# EAGLE schematic CarPC-CC-Integrated (EAGLE 9.5.2)
Car-PC Command & Control sowie Power Distribution Board für PC, Access-Point

## Sheet 1 of 5
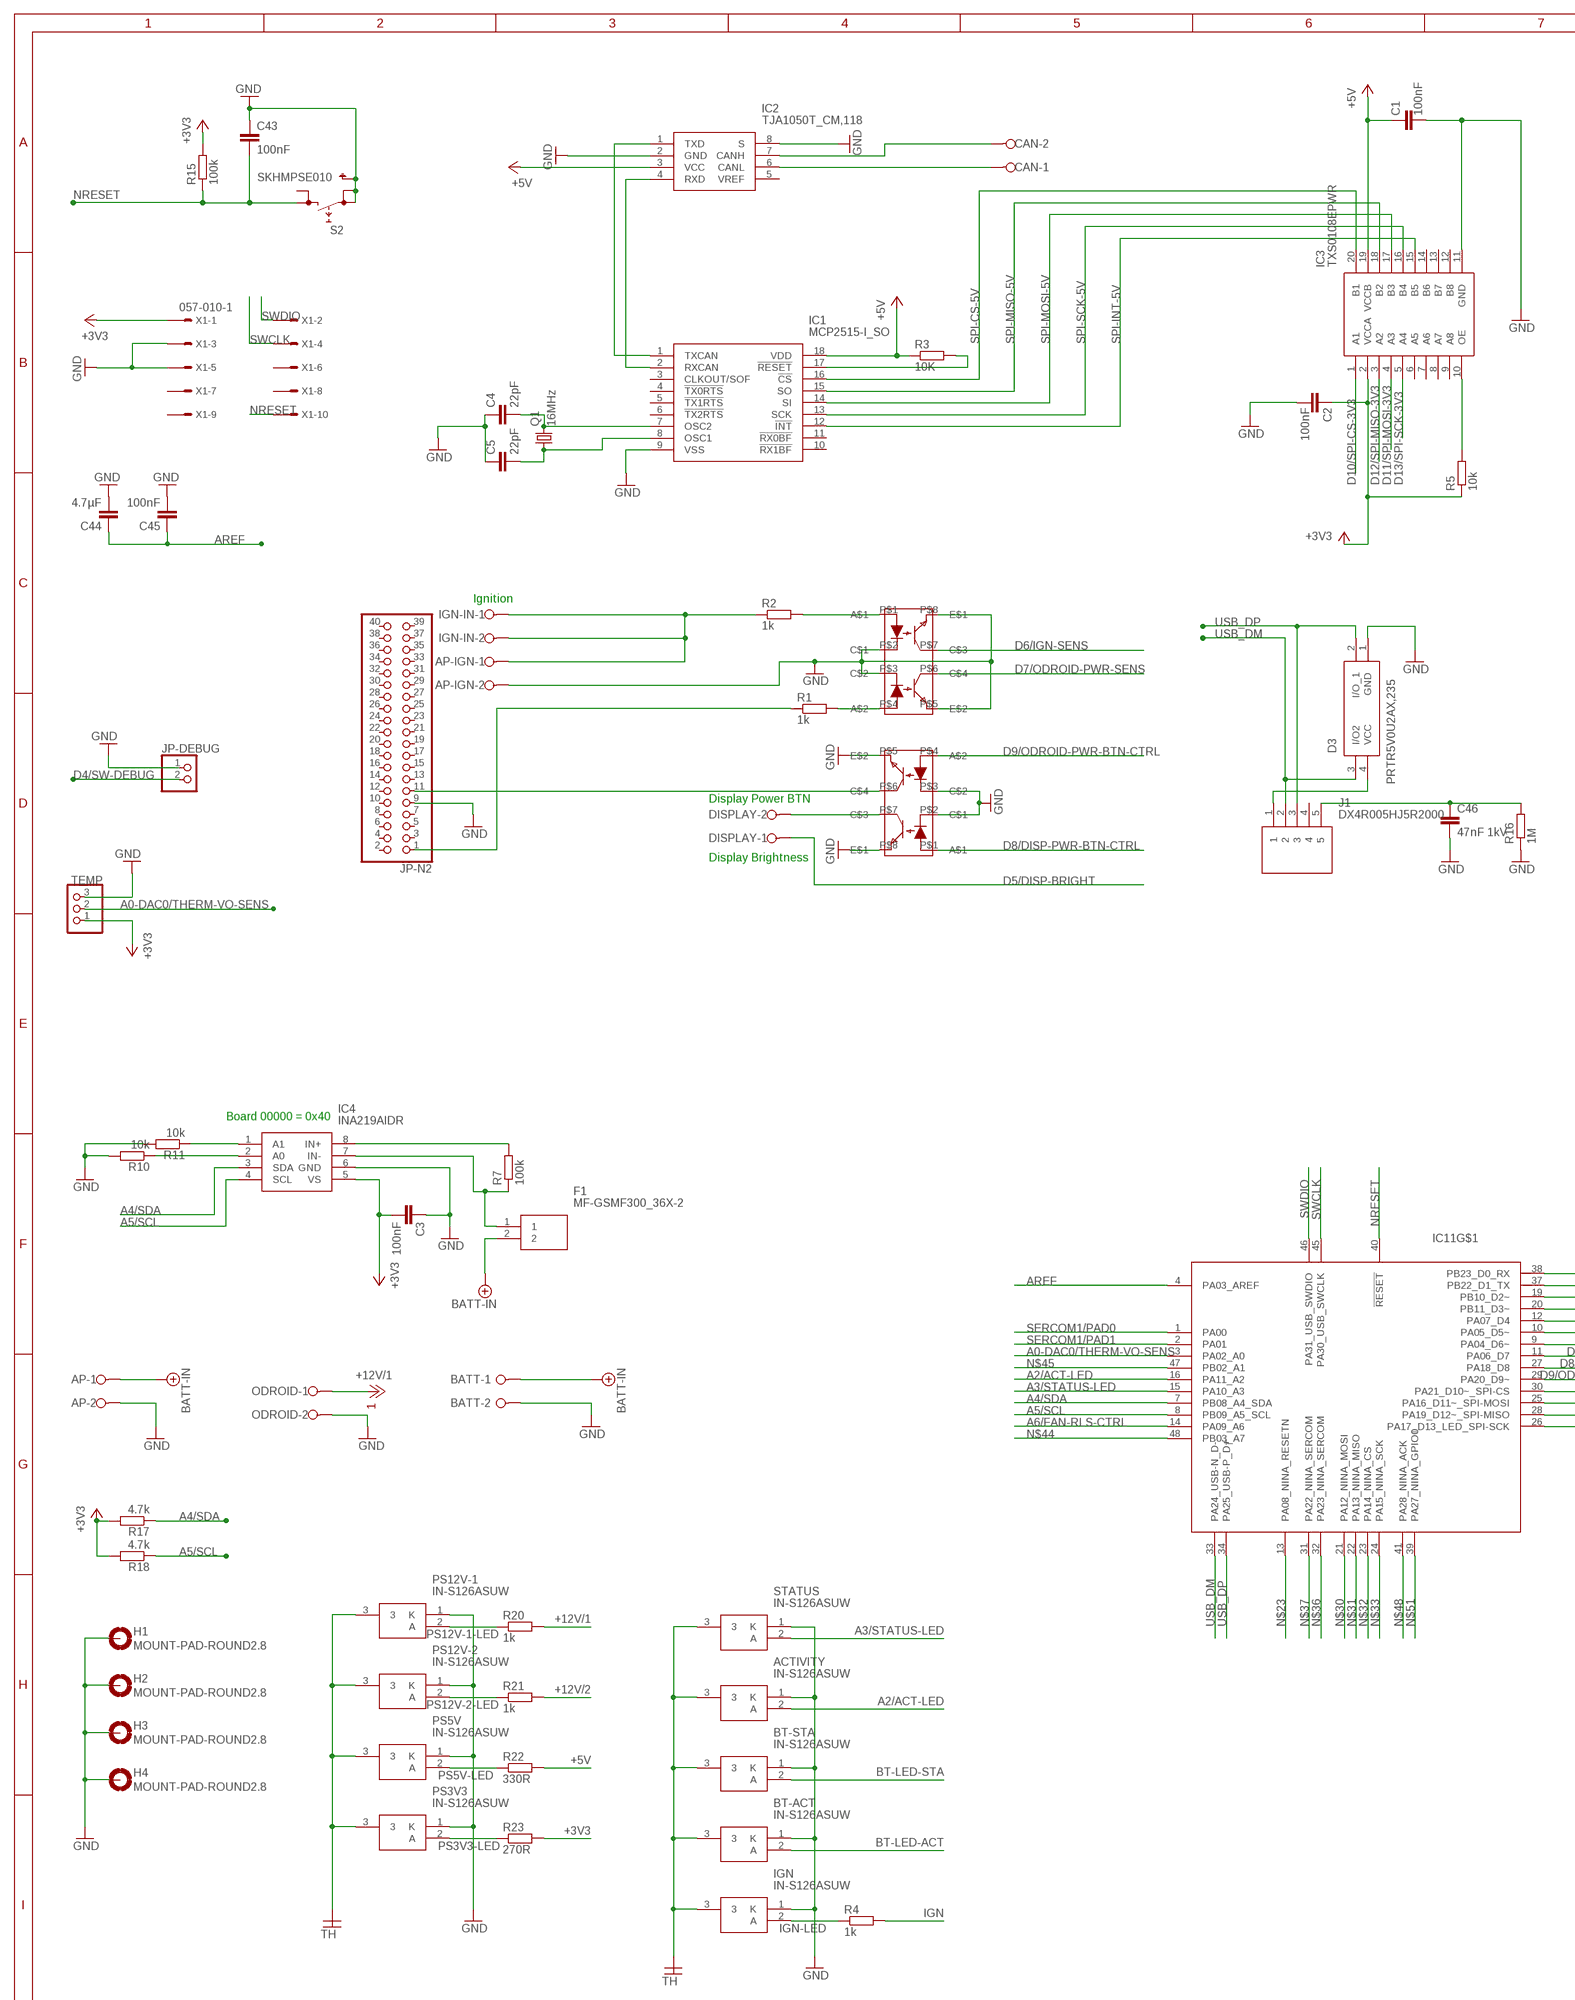
[diagram p0: schematic, sheet 1, part 1 of 2]
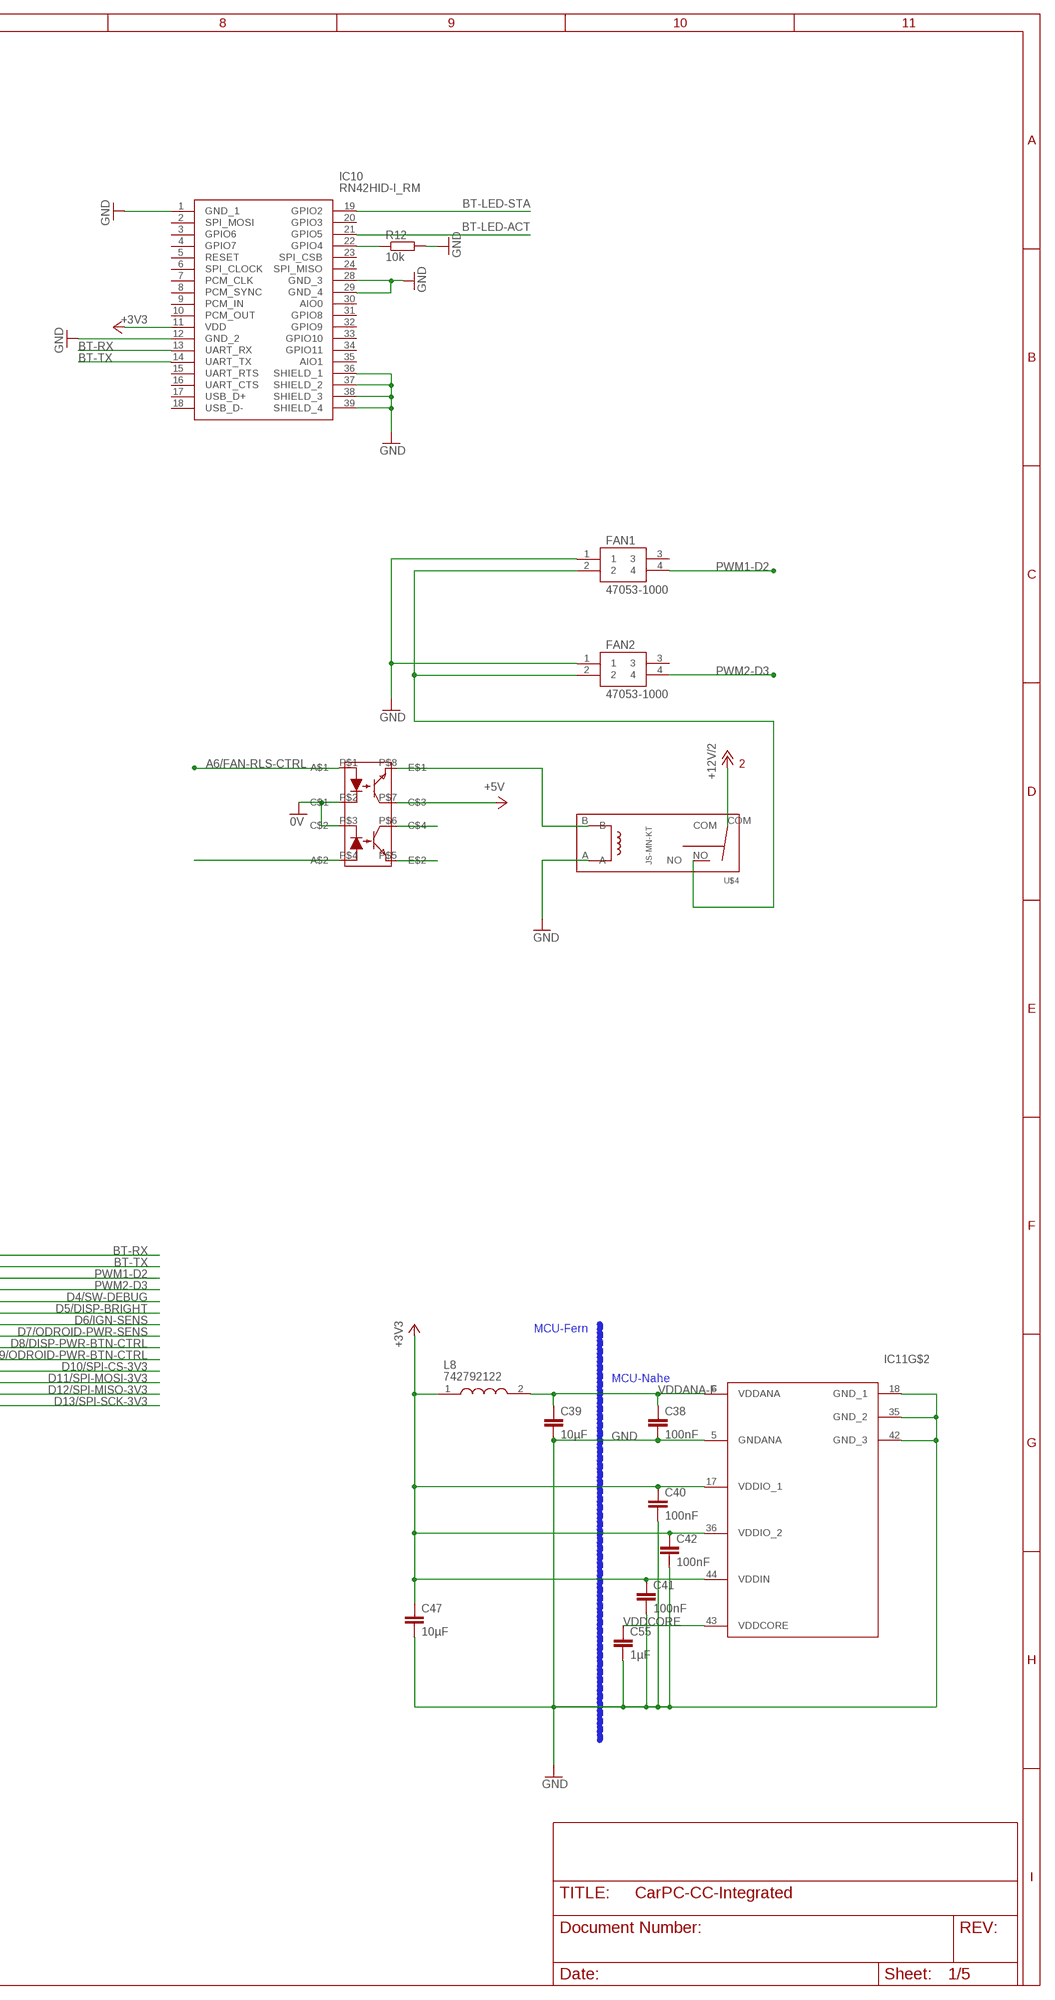
[diagram p1: schematic, sheet 1, part 2 of 2]

### Parts
ACTIVITY  IN-S126ASUW  [INS126ASUW]
AP  W237-02P  [W237-132]
AP-IGN  W237-02P  [W237-132]
BATT  W237-02P  [W237-132]
BT-ACT  IN-S126ASUW  [INS126ASUW]
BT-STA  IN-S126ASUW  [INS126ASUW]
C1  100nF  C-EUC1206  [C1206]
C2  100nF  C-EUC1206  [C1206]
C3  100nF  C-EUC1206  [C1206]
C4  22pF  C-EUC1206  [C1206]
C5  22pF  C-EUC1206  [C1206]
C38  100nF  C-EUC1206  [C1206]
C39  10µF  C-EUC1206  [C1206]
C40  100nF  C-EUC1206  [C1206]
C41  100nF  C-EUC1206  [C1206]
C42  100nF  C-EUC1206  [C1206]
C43  100nF  C-EUC1206  [C1206]
C44  4.7µF  C-EUC1206  [C1206]
C45  100nF  C-EUC1206  [C1206]
C46  47nF 1kV  C-EUC1206  [C1206]
C47  10µF  C-EUC1206  [C1206]
C55  1µF  C-EUC1206  [C1206]
CAN  W237-02P  [W237-132]
D3  PRTR5V0U2AX,235  [PESD2ETHAXR]
DISPLAY  W237-02P  [W237-132]
F1  MF-GSMF300_36X-2  [MFGSMF30036X2]
FAN1  47053-1000  [47053-1000]
FAN2  47053-1000  [47053-1000]
H1  MOUNT-PAD-ROUND2.8  [2,8-PAD]
H2  MOUNT-PAD-ROUND2.8  [2,8-PAD]
H3  MOUNT-PAD-ROUND2.8  [2,8-PAD]
H4  MOUNT-PAD-ROUND2.8  [2,8-PAD]
IC1  MCP2515-I_SO  [SOIC127P1030X265-18N]
IC2  TJA1050T_CM,118  [SOIC127P600X175-8N]
IC3  TXS0108EPWR  [SOP65P640X120-20N]
IC4  INA219AIDR  [SOIC127P600X175-8N]
IC10  RN42HID-I_RM  [RN42HIDIRM]
IC11  ATSAMD21G18A-AU-SPLIT  [QFP50P900X900X120-48N]
IGN  IN-S126ASUW  [INS126ASUW]
IGN-IN  W237-02P  [W237-132]
J1  DX4R005HJ5R2000  [DX4R005HJ5]
JP-DEBUG  PINHD-1X2  [1X02]
JP-N2  PINHD-2X20  [2X20]
L8  742792122  [INDC3216X130N]
ODROID  W237-02P  [W237-132]
OK-FAN-CTRL  ILD74  [FPR_ILD74]
OK-PWR-IGN  ILD74  [FPR_ILD74]
OK-PWR-N2_DISP  ILD74  [FPR_ILD74]
PS3V3  IN-S126ASUW  [INS126ASUW]
PS5V  IN-S126ASUW  [INS126ASUW]
PS12V-1  IN-S126ASUW  [INS126ASUW]
PS12V-2  IN-S126ASUW  [INS126ASUW]
Q1  16MHz  CRYSTALHC49S  [HC49/S]
R1  1k  R-EU_R1206  [R1206]
R2  1k  R-EU_R1206  [R1206]
R3  10K  R-EU_R1206  [R1206]
R4  1k  R-EU_R1206  [R1206]
R5  10k  R-EU_R1206  [R1206]
R7  100k  R-EU_R1206  [R1206]
R10  10k  R-EU_R1206  [R1206]
R11  10k  R-EU_R1206  [R1206]
R12  10k  R-EU_R1206  [R1206]
R15  100k  R-EU_R1206  [R1206]
R16  1M  R-EU_R1206  [R1206]
R17  4.7k  R-EU_R1206  [R1206]
R18  4.7k  R-EU_R1206  [R1206]
R20  1k  R-EU_R1206  [R1206]
R21  1k  R-EU_R1206  [R1206]
R22  330R  R-EU_R1206  [R1206]
R23  270R  R-EU_R1206  [R1206]
S2  SKHMPSE010  [SKHMPXE010]
STATUS  IN-S126ASUW  [INS126ASUW]
TEMP  PINHD-1X3/90  [1X03/90]
U$4  JS-MN-KT  [FPR_JS-MN-KT]
X1  057-010-1  [057-010-1]

### Nets
0V [Chassis]: OK-FAN-CTRL.P$2(C$1) OK-FAN-CTRL.P$3(C$2)
+3V3 [3V3 Arduino]: C2.1 C3.2 C40.1 C41.1 C42.1 C47.1 IC3.2(VCCA) IC4.5(VS) IC10.11(VDD) IC11.17(VDDIO_1) IC11.36(VDDIO_2) IC11.44(VDDIN) L8.1 R5.1 R15.2 R17.2 R18.2 R23.2 TEMP.1 X1.1 ; also sheet 4
+5V [5v Regulated]: C1.1 IC1.18(VDD) IC2.3(VCC) IC3.19(VCCB) OK-FAN-CTRL.P$7(C$3) R3.1 R22.2 ; also sheet 4
+12V/1: ODROID.1 R20.2 ; also sheet 2,4
+12V/2 [12v Regulated]: R21.2 U$4.COM ; also sheet 3
A0-DAC0/THERM-VO-SENS [3V3 Arduino]: IC11.3(PA02_A0) TEMP.2
A2/ACT-LED [3V3 Arduino]: ACTIVITY.2(A) IC11.16(PA11_A2)
A3/STATUS-LED [3V3 Arduino]: IC11.15(PA10_A3) STATUS.2(A)
A4/SDA [3V3 Signal]: IC4.3(SDA) IC11.7(PB08_A4_SDA) R17.1
A5/SCL [3V3 Signal]: IC4.4(SCL) IC11.8(PB09_A5_SCL) R18.1
A6/FAN-RLS-CTRL [3V3 Arduino]: IC11.14(PA09_A6) OK-FAN-CTRL.P$1(A$1)
AREF [3V3 Arduino]: C44.1 C45.1 IC11.4(PA03_AREF)
BATT-IN [11..14v Unfused]: AP.1 BATT.1 F1.2 ; also sheet 2,3
BATT-IN-FUSED [11..14v Generator]: F1.1 IC4.7(IN-) R7.1
BT-ACTIVATE [Chassis]: IC10.22(GPIO4) R12.1
BT-LED-ACT: BT-ACT.2(A) IC10.21(GPIO5)
BT-LED-STA: BT-STA.2(A) IC10.19(GPIO2)
BT-RX: IC10.13(UART_RX) IC11.38(PB23_D0_RX)
BT-TX: IC10.14(UART_TX) IC11.37(PB22_D1_TX)
CAN-H [5V Signal]: CAN.2 IC2.7(CANH)
CAN-L [5V Signal]: CAN.1 IC2.6(CANL)
D4/SW-DEBUG [3V3 Arduino]: IC11.12(PA07_D4) JP-DEBUG.2
D5/DISP-BRIGHT [3V3 Arduino]: DISPLAY.1 IC11.10(PA05_D5~)
D6/IGN-SENS [3V3 Arduino]: IC11.9(PA04_D6~) OK-PWR-IGN.P$7(C$3)
D7/ODROID-PWR-SENS [3V3 Arduino]: IC11.11(PA06_D7) OK-PWR-IGN.P$6(C$4)
D8/DISP-PWR-BTN-CTRL [3V3 Arduino]: IC11.27(PA18_D8) OK-PWR-N2_DISP.P$1(A$1)
D9/ODROID-PWR-BTN-CTRL [3V3 Arduino]: IC11.29(PA20_D9~) OK-PWR-N2_DISP.P$4(A$2)
D10/SPI-CS-3V3 [3V3 Signal]: IC3.1(A1) IC11.30(PA21_D10~_SPI-CS)
D11/SPI-MOSI-3V3 [3V3 Signal]: IC3.4(A3) IC11.25(PA16_D11~_SPI-MOSI)
D12/SPI-MISO-3V3 [3V3 Signal]: IC3.3(A2) IC11.28(PA19_D12~_SPI-MISO)
D13/SPI-SCK-3V3 [3V3 Signal]: IC3.5(A4) IC11.26(PA17_D13_LED_SPI-SCK)
DISP-PWR-BTN [3V3 Signal]: DISPLAY.2 OK-PWR-N2_DISP.P$7(C$3)
FAN-12V [12v Regulated]: FAN1.2 FAN2.2 U$4.NO
FAN-RLS-TRIG [5v Regulated]: OK-FAN-CTRL.P$8(E$1) U$4.B
GND [Chassis]: ACTIVITY.1(K) AP-IGN.2 AP.2 BATT.2 BT-ACT.1(K) BT-STA.1(K) C1.2 C2.2 C3.1 C4.1 C5.1 C38.2 C39.2 C40.2 C41.2 C42.2 C43.1 C44.2 C45.2 C46.2 C47.2 C55.2 D3.1(GND) FAN1.1 FAN2.1 H1.B2,8(MOUNT) H2.B2,8(MOUNT) H3.B2,8(MOUNT) H4.B2,8(MOUNT) IC1.9(VSS) IC2.2(GND) IC2.8(S) IC3.11(GND) IC4.6(GND) IC10.1(GND_1) IC10.12(GND_2) IC10.28(GND_3) IC10.29(GND_4) IC10.36(SHIELD_1) IC10.37(SHIELD_2) IC10.38(SHIELD_3) IC10.39(SHIELD_4) IC11.5(GNDANA) IC11.18(GND_1) IC11.35(GND_2) IC11.42(GND_3) IGN.1(K) JP-DEBUG.1 JP-N2.9 ODROID.2 OK-PWR-IGN.P$2(C$1) OK-PWR-IGN.P$3(C$2) OK-PWR-IGN.P$5(E$2) OK-PWR-IGN.P$8(E$1) OK-PWR-N2_DISP.P$2(C$1) OK-PWR-N2_DISP.P$3(C$2) OK-PWR-N2_DISP.P$5(E$2) OK-PWR-N2_DISP.P$8(E$1) PS3V3.1(K) PS5V.1(K) PS12V-1.1(K) PS12V-2.1(K) R10.2 R11.2 R12.2 R16.1 S2.1(1.1) S2.2(1.2) S2.5(SH) STATUS.1(K) TEMP.3 U$4.A X1.3 X1.5 ; also sheet 2,3,4
IGN [11..14v Ignition]: AP-IGN.1 IGN-IN.1 IGN-IN.2 R2.1 R4.2
IGN-IN [12v Regulated]: OK-PWR-IGN.P$1(A$1) R2.2
IGN-LED [11..14v Ignition]: IGN.2(A) R4.1
INA-0X40-ADDR0: IC4.2(A0) R10.1
INA-0X40-ADDR1: IC4.1(A1) R11.1
MCP-OSC1 [5V Signal]: C5.2 IC1.8(OSC1) Q1.1
MCP-OSC2 [5V Signal]: C4.2 IC1.7(OSC2) Q1.2
MCP-RESET: IC1.17(!RESET) R3.2
MCP-TJA-RX [5V Signal]: IC1.2(RXCAN) IC2.4(RXD)
MCP-TJA-TX [5V Signal]: IC1.1(TXCAN) IC2.1(TXD)
N$3: OK-FAN-CTRL.P$4(A$2)
N$4: OK-FAN-CTRL.P$6(C$4)
N$6: OK-FAN-CTRL.P$5(E$2)
N$23: IC11.13(PA08_NINA_RESETN)
N$25: D3.4(VCC) J1.1
N$30: IC11.21(PA12_NINA_MOSI)
N$31: IC11.22(PA13_NINA_MISO)
N$32: IC11.23(PA14_NINA_CS)
N$33: IC11.24(PA15_NINA_SCK)
N$36: IC11.32(PA23_NINA_SERCOM)
N$37: IC11.31(PA22_NINA_SERCOM)
N$44: IC11.48(PB03_A7)
N$45: IC11.47(PB02_A1)
N$48: IC11.41(PA28_NINA_ACK)
N$51: IC11.39(PA27_NINA_GPIO0)
NRESET: C43.2 IC11.40(!RESET) R15.1 S2.3(2.1) X1.10
ODROID-3V3 [3V3 Arduino]: JP-N2.1 R1.1
ODROID-3V3$2: OK-PWR-IGN.P$4(A$2) R1.2
ODROID-PWR-BTN [3V3 Signal]: JP-N2.11 OK-PWR-N2_DISP.P$6(C$4)
OE [3V3 Arduino]: IC3.10(OE) R5.2
PS3V3-LED [3V3 Arduino]: PS3V3.2(A) R23.1
PS5V-LED [5v Regulated]: PS5V.2(A) R22.1
PS12V-1-LED: PS12V-1.2(A) R20.1
PS12V-2-LED [12v Regulated]: PS12V-2.2(A) R21.1
PWM1-D2 [3V3 Signal]: FAN1.4 IC11.19(PB10_D2~)
PWM2-D3 [3V3 Signal]: FAN2.4 IC11.20(PB11_D3~)
SERCOM1/PAD0: IC11.1(PA00)
SERCOM1/PAD1: IC11.2(PA01)
SHUNT+ [11..14v Generator]: IC4.8(IN+) R7.2
SPI-CS-5V [5V Signal]: IC1.16(!CS) IC3.20(B1)
SPI-INT-5V [5V Signal]: IC1.12(!INT) IC3.15(B5)
SPI-MISO-5V [5V Signal]: IC1.15(SO) IC3.18(B2)
SPI-MOSI-5V [5V Signal]: IC1.14(SI) IC3.17(B3)
SPI-SCK-5V [5V Signal]: IC1.13(SCK) IC3.16(B4)
SWCLK: IC11.45(PA30_USB_SWCLK) X1.4
SWDIO: IC11.46(PA31_USB_SWDIO) X1.2
TH: ACTIVITY.3 BT-ACT.3 BT-STA.3 IGN.3 PS3V3.3 PS5V.3 PS12V-1.3 PS12V-2.3 STATUS.3
USB-GND [Chassis]: C46.1 J1.5 R16.2
USB_DM [5V Signal]: D3.3(I/O2) IC11.33(PA24_USB-N_D-) J1.2
USB_DP [5V Signal]: D3.2(I/O_1) IC11.34(PA25_USB-P_D+) J1.3
VDDANA-F [3V3 Arduino]: C38.1 C39.1 IC11.6(VDDANA) L8.2
VDDCORE: C55.1 IC11.43(VDDCORE)
Unconnected: FAN1.3 FAN2.3 IC1.3(CLKOUT/SOF) IC1.4(!TX0RTS) IC1.5(!TX1RTS) IC1.6(!TX2RTS) IC1.10(!RX1BF) IC1.11(!RX0BF) IC2.5(VREF) IC3.6(A5) IC3.7(A6) IC3.8(A7) IC3.9(A8) IC3.12(B8) IC3.13(B7) IC3.14(B6) IC10.2(SPI_MOSI) IC10.3(GPIO6) IC10.4(GPIO7) IC10.5(RESET) IC10.6(SPI_CLOCK) IC10.7(PCM_CLK) IC10.8(PCM_SYNC) IC10.9(PCM_IN) IC10.10(PCM_OUT) IC10.15(UART_RTS) IC10.16(UART_CTS) IC10.17(USB_D+) IC10.18(USB_D-) IC10.20(GPIO3) IC10.23(SPI_CSB) IC10.24(SPI_MISO) IC10.30(AIO0) IC10.31(GPIO8) IC10.32(GPIO9) IC10.33(GPIO10) IC10.34(GPIO11) IC10.35(AIO1) J1.4 JP-N2.2 JP-N2.3 JP-N2.4 JP-N2.5 JP-N2.6 JP-N2.7 JP-N2.8 JP-N2.10 JP-N2.12 JP-N2.13 JP-N2.14 JP-N2.15 JP-N2.16 JP-N2.17 JP-N2.18 JP-N2.19 JP-N2.20 JP-N2.21 JP-N2.22 JP-N2.23 JP-N2.24 JP-N2.25 JP-N2.26 JP-N2.27 JP-N2.28 JP-N2.29 JP-N2.30 JP-N2.31 JP-N2.32 JP-N2.33 JP-N2.34 JP-N2.35 JP-N2.36 JP-N2.37 JP-N2.38 JP-N2.39 JP-N2.40 S2.4(2.2) X1.6 X1.7 X1.8 X1.9

### Notes on the sheet
- Ignition
- Display Power BTN
- Display Brightness
- Board 00000 = 0x40
- MCU-Fern
- MCU-Nahe

## Sheet 2 of 5: 12V Power Supply Rail 1 (PC)
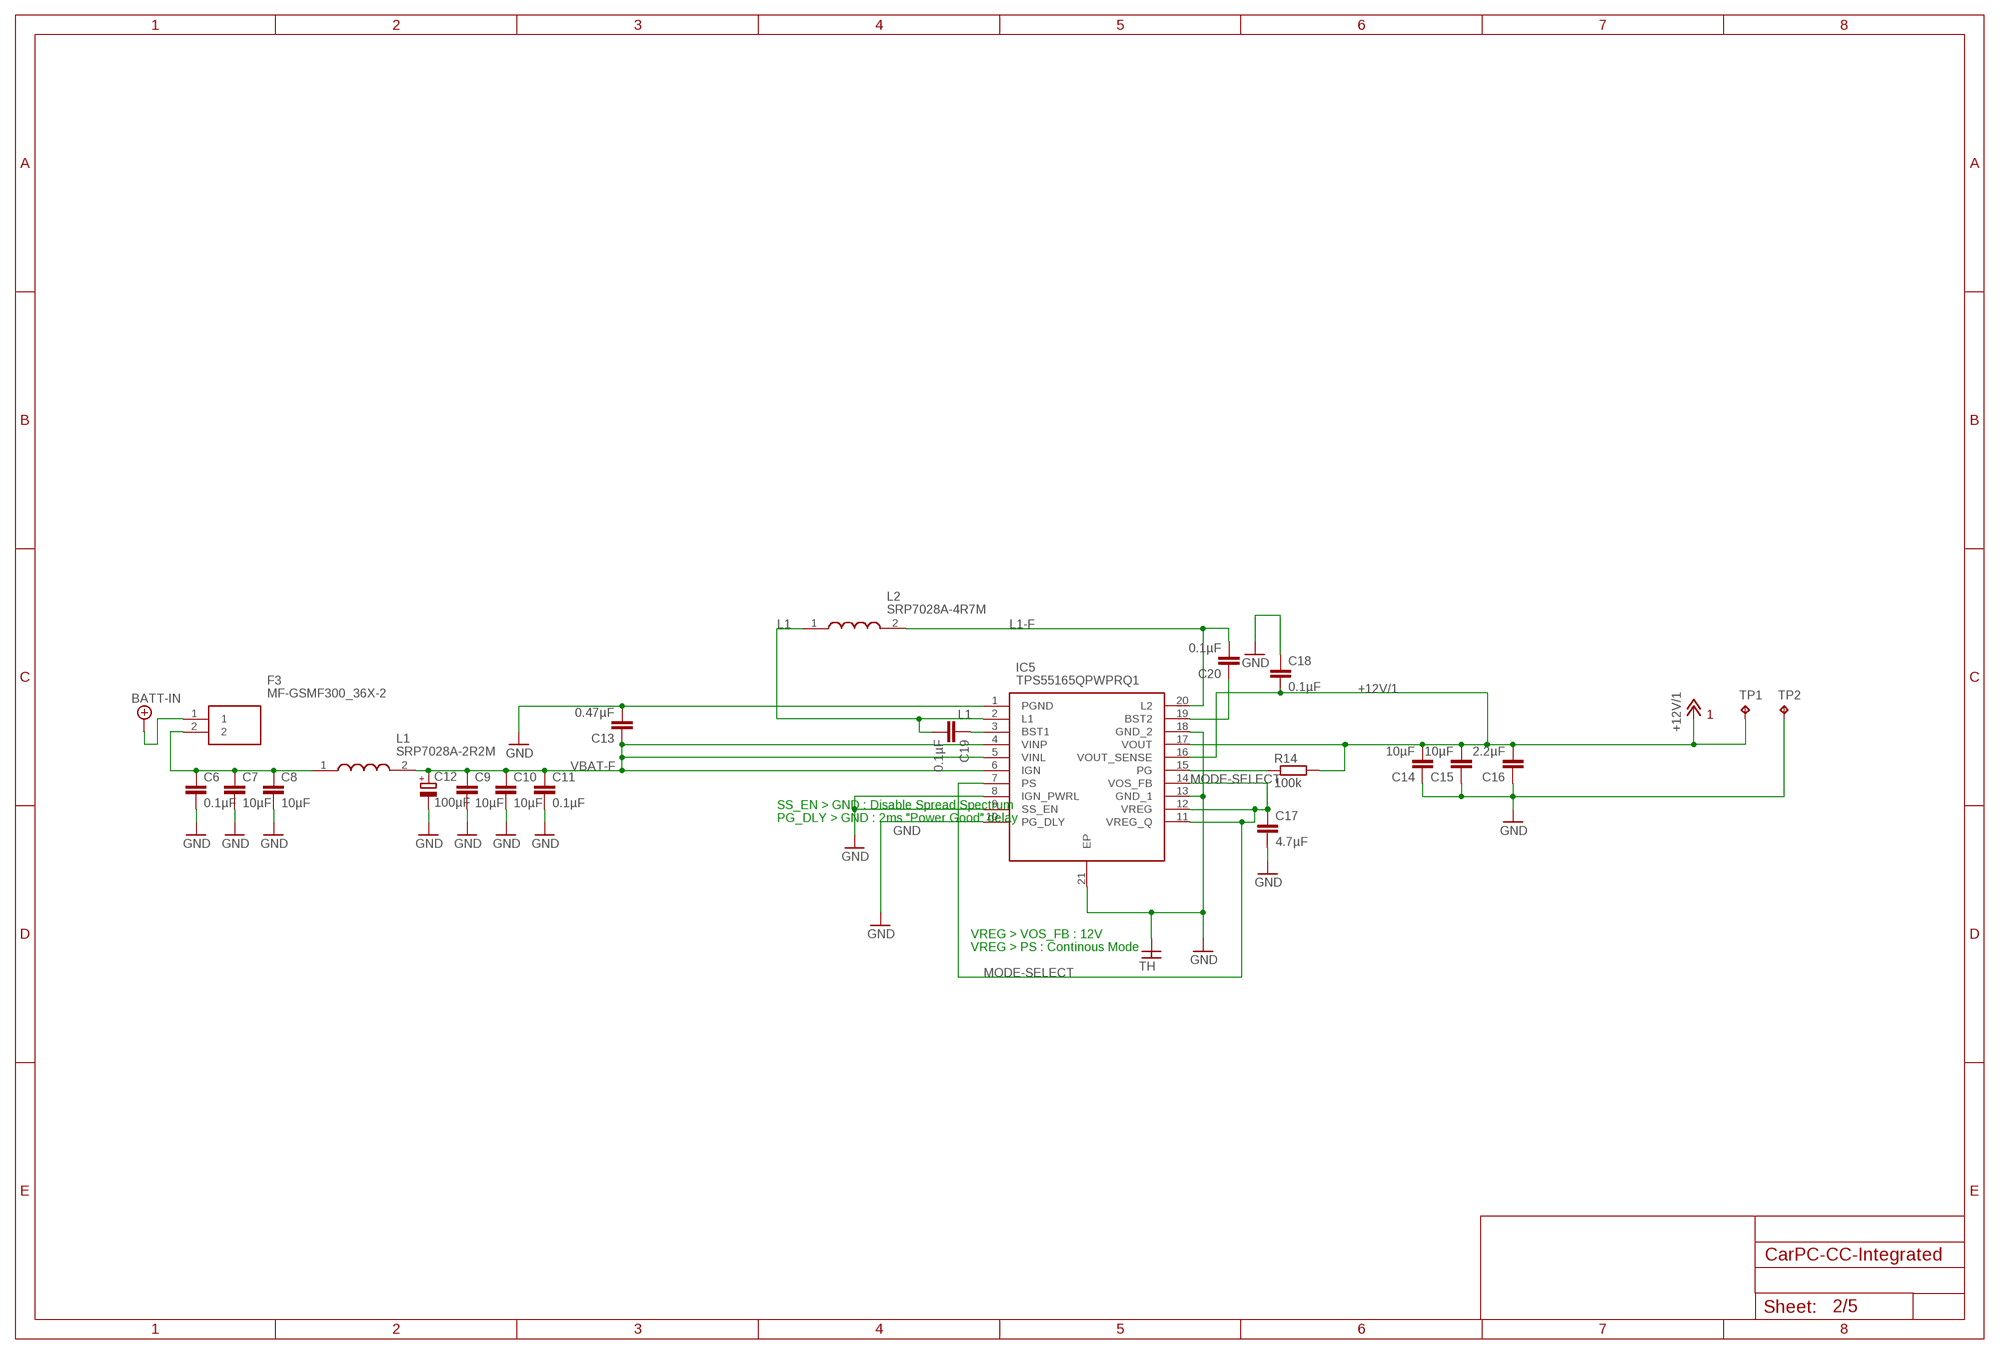
[diagram p2: schematic, sheet 2]

### Parts
C6  0.1µF  C-EUC1206  [C1206]
C7  10µF  C-EUC1206  [C1206]
C8  10µF  C-EUC1206  [C1206]
C9  10µF  C-EUC1206  [C1206]
C10  10µF  C-EUC1206  [C1206]
C11  0.1µF  C-EUC1206  [C1206]
C12  100µF  CPOL-EUSMCB  [SMC_B]
C13  0.47µF  C-EUC1206  [C1206]
C14  10µF  C-EUC1206  [C1206]
C15  10µF  C-EUC1206  [C1206]
C16  2.2µF  C-EUC1206  [C1206]
C17  4.7µF  C-EUC1206  [C1206]
C18  0.1µF  C-EUC1206  [C1206]
C19  0.1µF  C-EUC1206  [C1206]
C20  0.1µF  C-EUC1206  [C1206]
F3  MF-GSMF300_36X-2  [MFGSMF30036X2]
IC5  TPS55165QPWPRQ1  [SOP65P640X120-21N]
L1  SRP7028A-2R2M  [INDM7366X300N]
L2  SRP7028A-4R7M  [INDM7366X300N]
R14  100k  R-EU_R1206  [R1206]
TP1  TPTP20R  [TP20R]
TP2  TPTP20R  [TP20R]

### Nets
+12V/1: C14.2 C15.2 C16.2 C18.2 IC5.16(VOUT_SENSE) IC5.17(VOUT) R14.2 TP1.TP ; also sheet 1,4
BATT-F [11..14v Generator]: C6.1 C7.1 C8.1 F3.2 L1.1
BATT-IN [11..14v Unfused]: F3.1 ; also sheet 1,3
BST1 [12v Regulated]: C19.1 IC5.3(BST1)
BST2: C20.1 IC5.19(BST2)
GND [Chassis]: C6.2 C7.2 C8.2 C9.2 C10.2 C11.2 C12.- C13.2 C14.1 C15.1 C16.1 C17.2 C18.1 IC5.1(PGND) IC5.8(IGN_PWRL) IC5.9(SS_EN) IC5.10(PG_DLY) IC5.13(GND_1) IC5.18(GND_2) IC5.21(EP) TP2.TP ; supply symbol labelled TH ; also sheet 1,3,4
L1 [12v Regulated]: C19.2 IC5.2(L1) L2.1
L1-F [12v Regulated]: C20.2 IC5.20(L2) L2.2
MODE-SELECT: C17.1 IC5.7(PS) IC5.11(VREG_Q) IC5.12(VREG) IC5.14(VOS_FB)
POWER-GOOD/1: IC5.15(PG) R14.1
VBAT-F [11..14v Generator]: C9.1 C10.1 C11.1 C12.+ C13.1 IC5.4(VINP) IC5.5(VINL) IC5.6(IGN) L1.2

### Notes on the sheet
- SS_EN > GND : Disable Spread Spectrum
- PG_DLY > GND : 2ms "Power Good" delay
- VREG > VOS_FB : 12V
- VREG > PS : Continous Mode

## Sheet 3 of 5: 12V Power Supply Rail 2 (Fans)
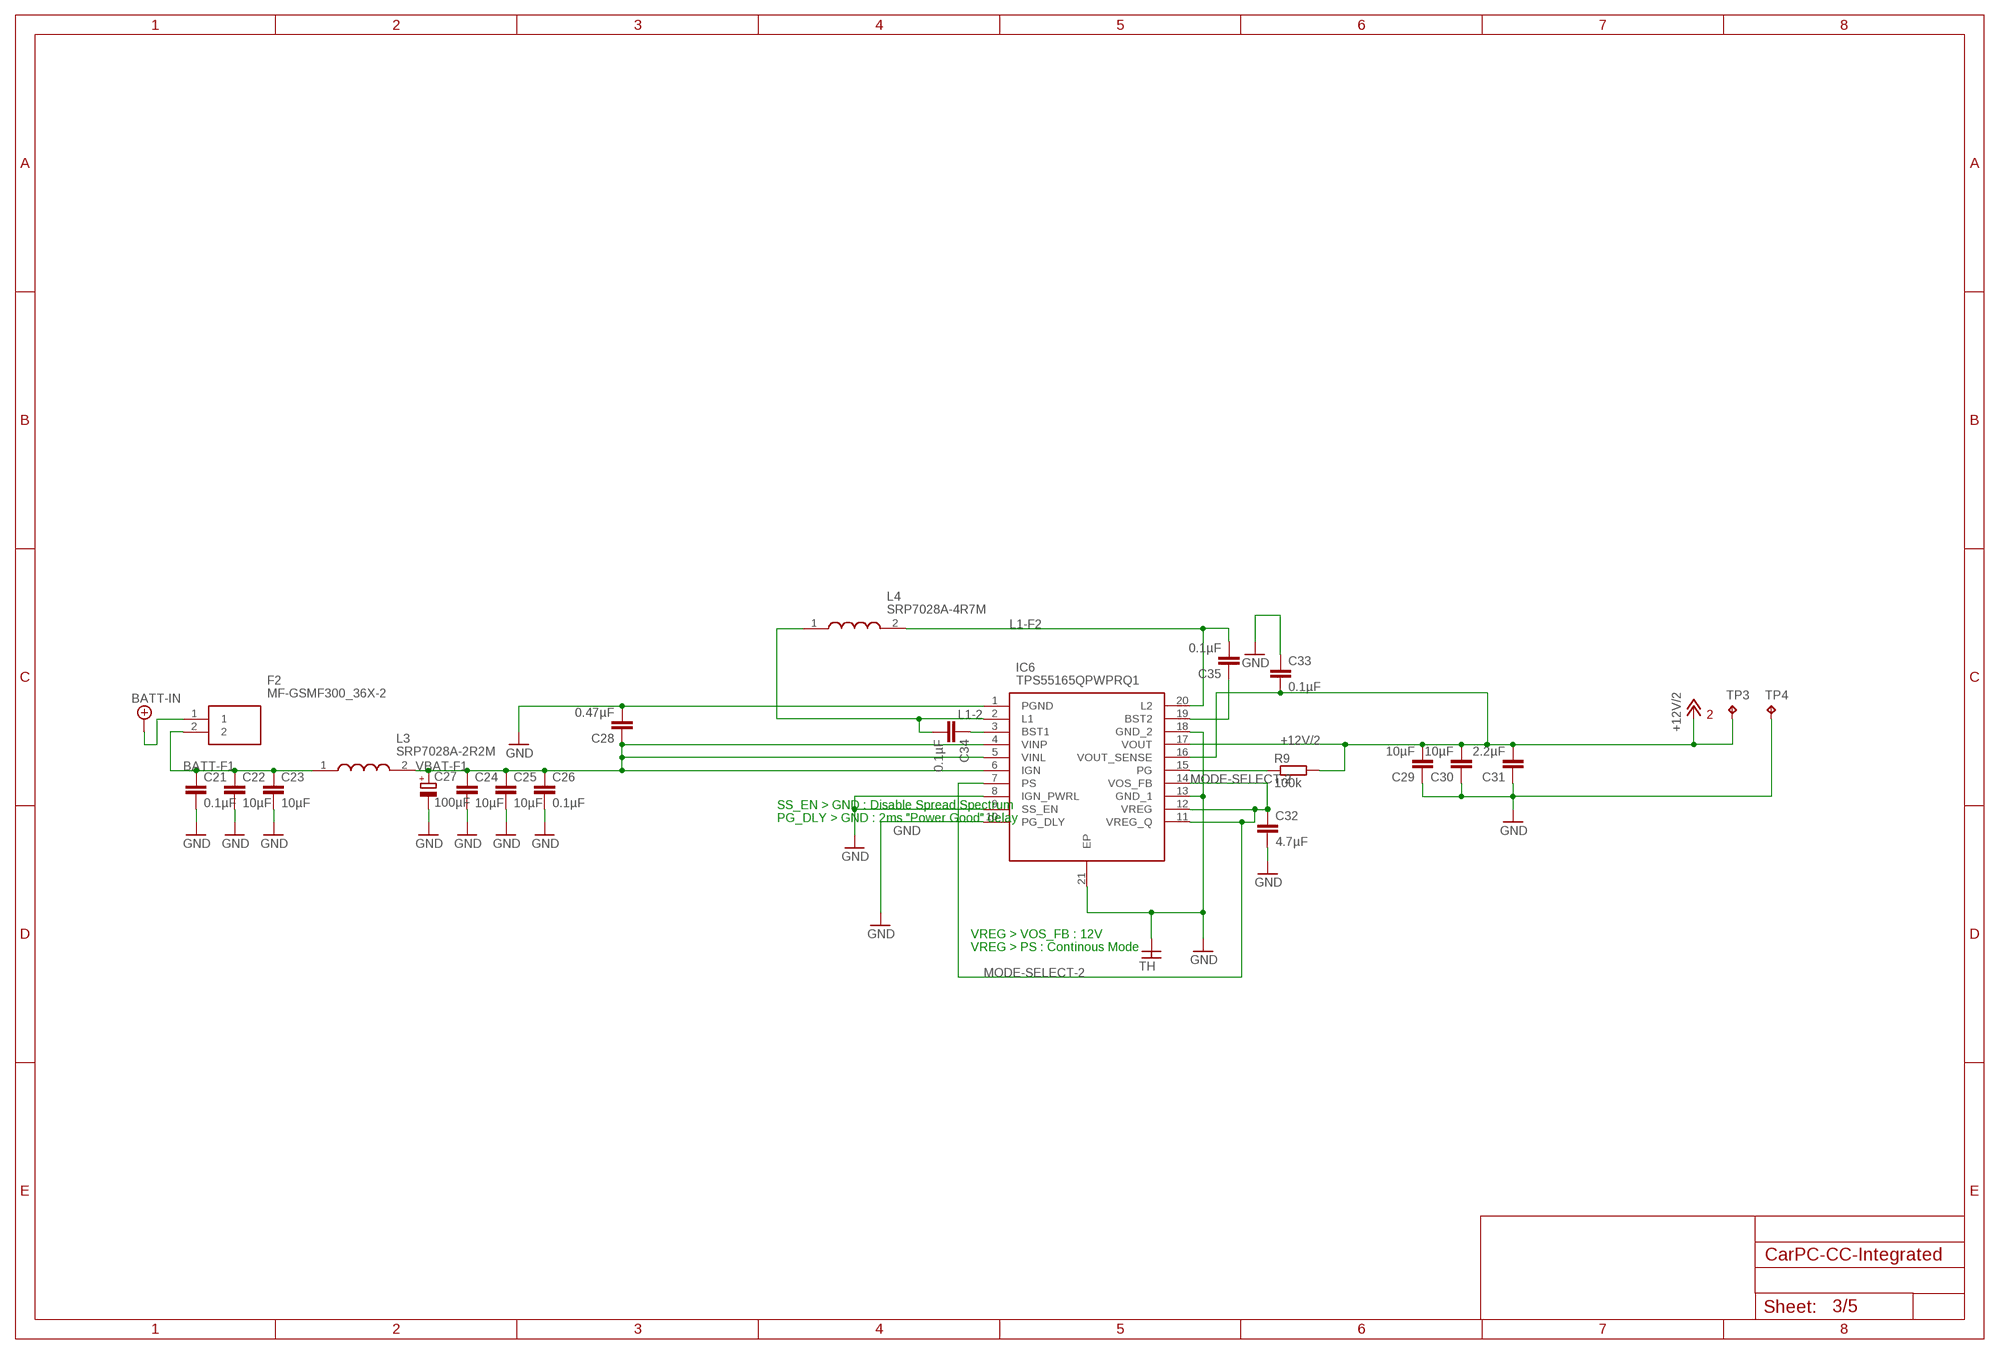
[diagram p3: schematic, sheet 3]

### Parts
C21  0.1µF  C-EUC1206  [C1206]
C22  10µF  C-EUC1206  [C1206]
C23  10µF  C-EUC1206  [C1206]
C24  10µF  C-EUC1206  [C1206]
C25  10µF  C-EUC1206  [C1206]
C26  0.1µF  C-EUC1206  [C1206]
C27  100µF  CPOL-EUSMCB  [SMC_B]
C28  0.47µF  C-EUC1206  [C1206]
C29  10µF  C-EUC1206  [C1206]
C30  10µF  C-EUC1206  [C1206]
C31  2.2µF  C-EUC1206  [C1206]
C32  4.7µF  C-EUC1206  [C1206]
C33  0.1µF  C-EUC1206  [C1206]
C34  0.1µF  C-EUC1206  [C1206]
C35  0.1µF  C-EUC1206  [C1206]
F2  MF-GSMF300_36X-2  [MFGSMF30036X2]
IC6  TPS55165QPWPRQ1  [SOP65P640X120-21N]
L3  SRP7028A-2R2M  [INDM7366X300N]
L4  SRP7028A-4R7M  [INDM7366X300N]
R9  100k  R-EU_R1206  [R1206]
TP3  TPTP20R  [TP20R]
TP4  TPTP20R  [TP20R]

### Nets
+12V/2 [12v Regulated]: C29.2 C30.2 C31.2 C33.2 IC6.16(VOUT_SENSE) IC6.17(VOUT) R9.2 TP3.TP ; also sheet 1
BATT-F1 [11..14v Generator]: C21.1 C22.1 C23.1 F2.2 L3.1
BATT-IN [11..14v Unfused]: F2.1 ; also sheet 1,2
BST1-2 [12v Regulated]: C34.1 IC6.3(BST1)
BST2-2: C35.1 IC6.19(BST2)
GND [Chassis]: C21.2 C22.2 C23.2 C24.2 C25.2 C26.2 C27.- C28.2 C29.1 C30.1 C31.1 C32.2 C33.1 IC6.1(PGND) IC6.8(IGN_PWRL) IC6.9(SS_EN) IC6.10(PG_DLY) IC6.13(GND_1) IC6.18(GND_2) IC6.21(EP) TP4.TP ; supply symbol labelled TH ; also sheet 1,2,4
L1-2 [12v Regulated]: C34.2 IC6.2(L1) L4.1
L1-F2 [12v Regulated]: C35.2 IC6.20(L2) L4.2
MODE-SELECT-2: C32.1 IC6.7(PS) IC6.11(VREG_Q) IC6.12(VREG) IC6.14(VOS_FB)
POWER-GOOD/2: IC6.15(PG) R9.1
VBAT-F1 [11..14v Generator]: C24.1 C25.1 C26.1 C27.+ C28.1 IC6.4(VINP) IC6.5(VINL) IC6.6(IGN) L3.2

### Notes on the sheet
- SS_EN > GND : Disable Spread Spectrum
- PG_DLY > GND : 2ms "Power Good" delay
- VREG > VOS_FB : 12V
- VREG > PS : Continous Mode

## Sheet 4 of 5: 3V3 and 5V Converters for ATSAMD21 and supplemental ICs
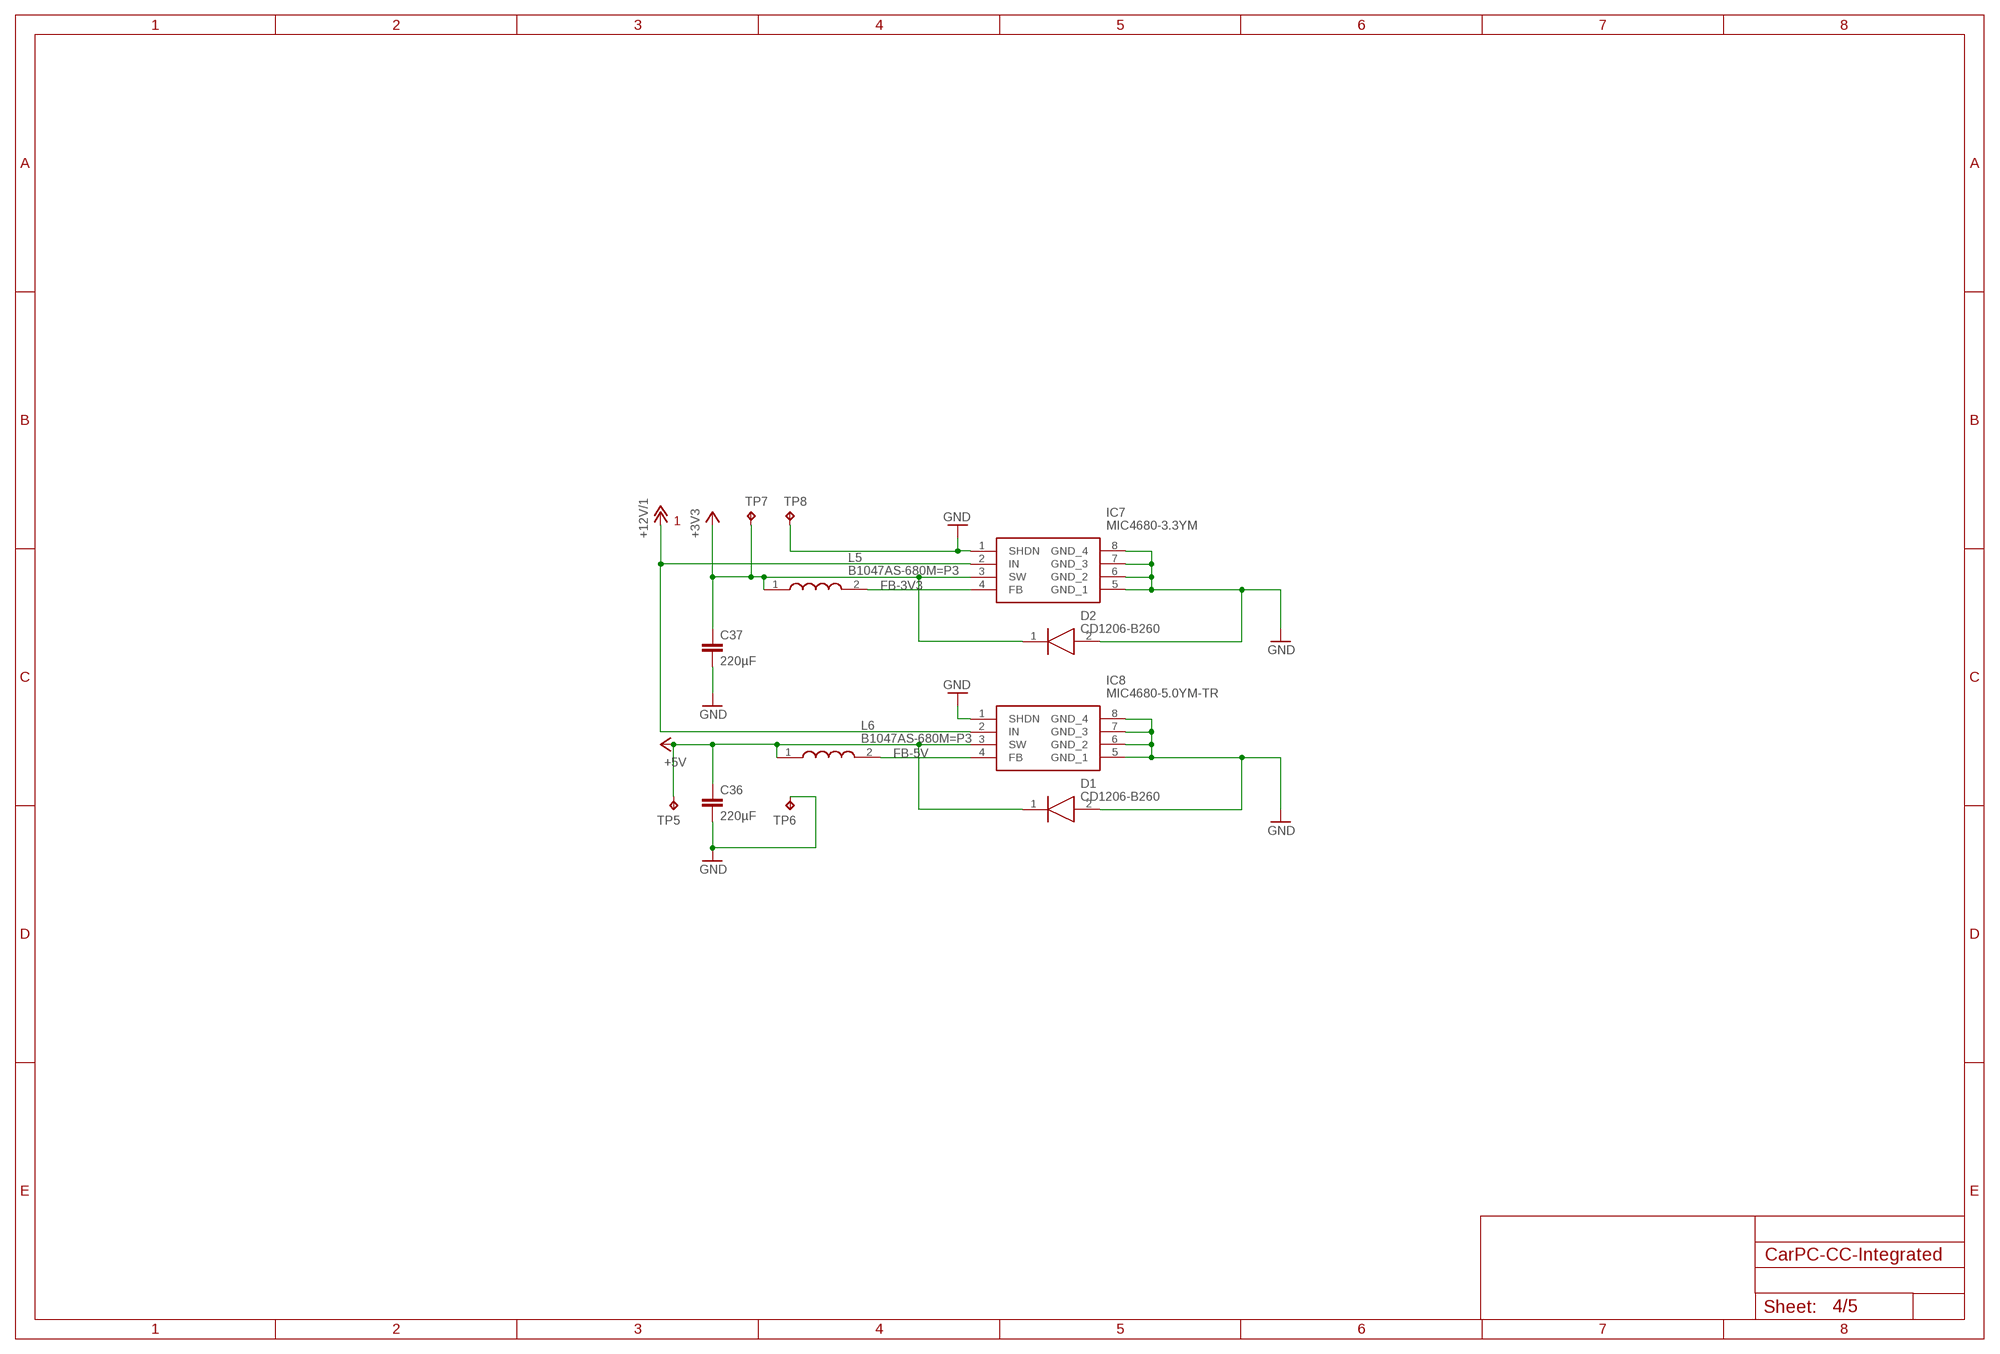
[diagram p4: schematic, sheet 4]

### Parts
C36  220µF  C-EUC1206  [C1206]
C37  220µF  C-EUC1206  [C1206]
D1  CD1206-B260  [DIOC3419X116N]
D2  CD1206-B260  [DIOC3419X116N]
IC7  MIC4680-3.3YM  [SOIC127P599X173-8N]
IC8  MIC4680-5.0YM-TR  [SOIC127P599X173-8N]
L5  B1047AS-680M=P3  [INDPM7373X500N]
L6  B1047AS-680M=P3  [INDPM7373X500N]
TP5  TPTP20R  [TP20R]
TP6  TPTP20R  [TP20R]
TP7  TPTP20R  [TP20R]
TP8  TPTP20R  [TP20R]

### Nets
+3V3 [3V3 Arduino]: C37.1 D2.1(K) IC7.3(SW) L5.1 TP7.TP ; also sheet 1
+5V [5v Regulated]: C36.1 D1.1(K) IC8.3(SW) L6.1 TP5.TP ; also sheet 1
+12V/1: IC7.2(IN) IC8.2(IN) ; also sheet 1,2
FB-3V3 [3V3 Arduino]: IC7.4(FB) L5.2
FB-5V [5v Regulated]: IC8.4(FB) L6.2
GND [Chassis]: C36.2 C37.2 D1.2(A) D2.2(A) IC7.1(SHDN) IC7.5(GND_1) IC7.6(GND_2) IC7.7(GND_3) IC7.8(GND_4) IC8.1(SHDN) IC8.5(GND_1) IC8.6(GND_2) IC8.7(GND_3) IC8.8(GND_4) TP6.TP TP8.TP ; also sheet 1,2,3

## Sheet 5 of 5: ATSAMD21G18 Power Supply
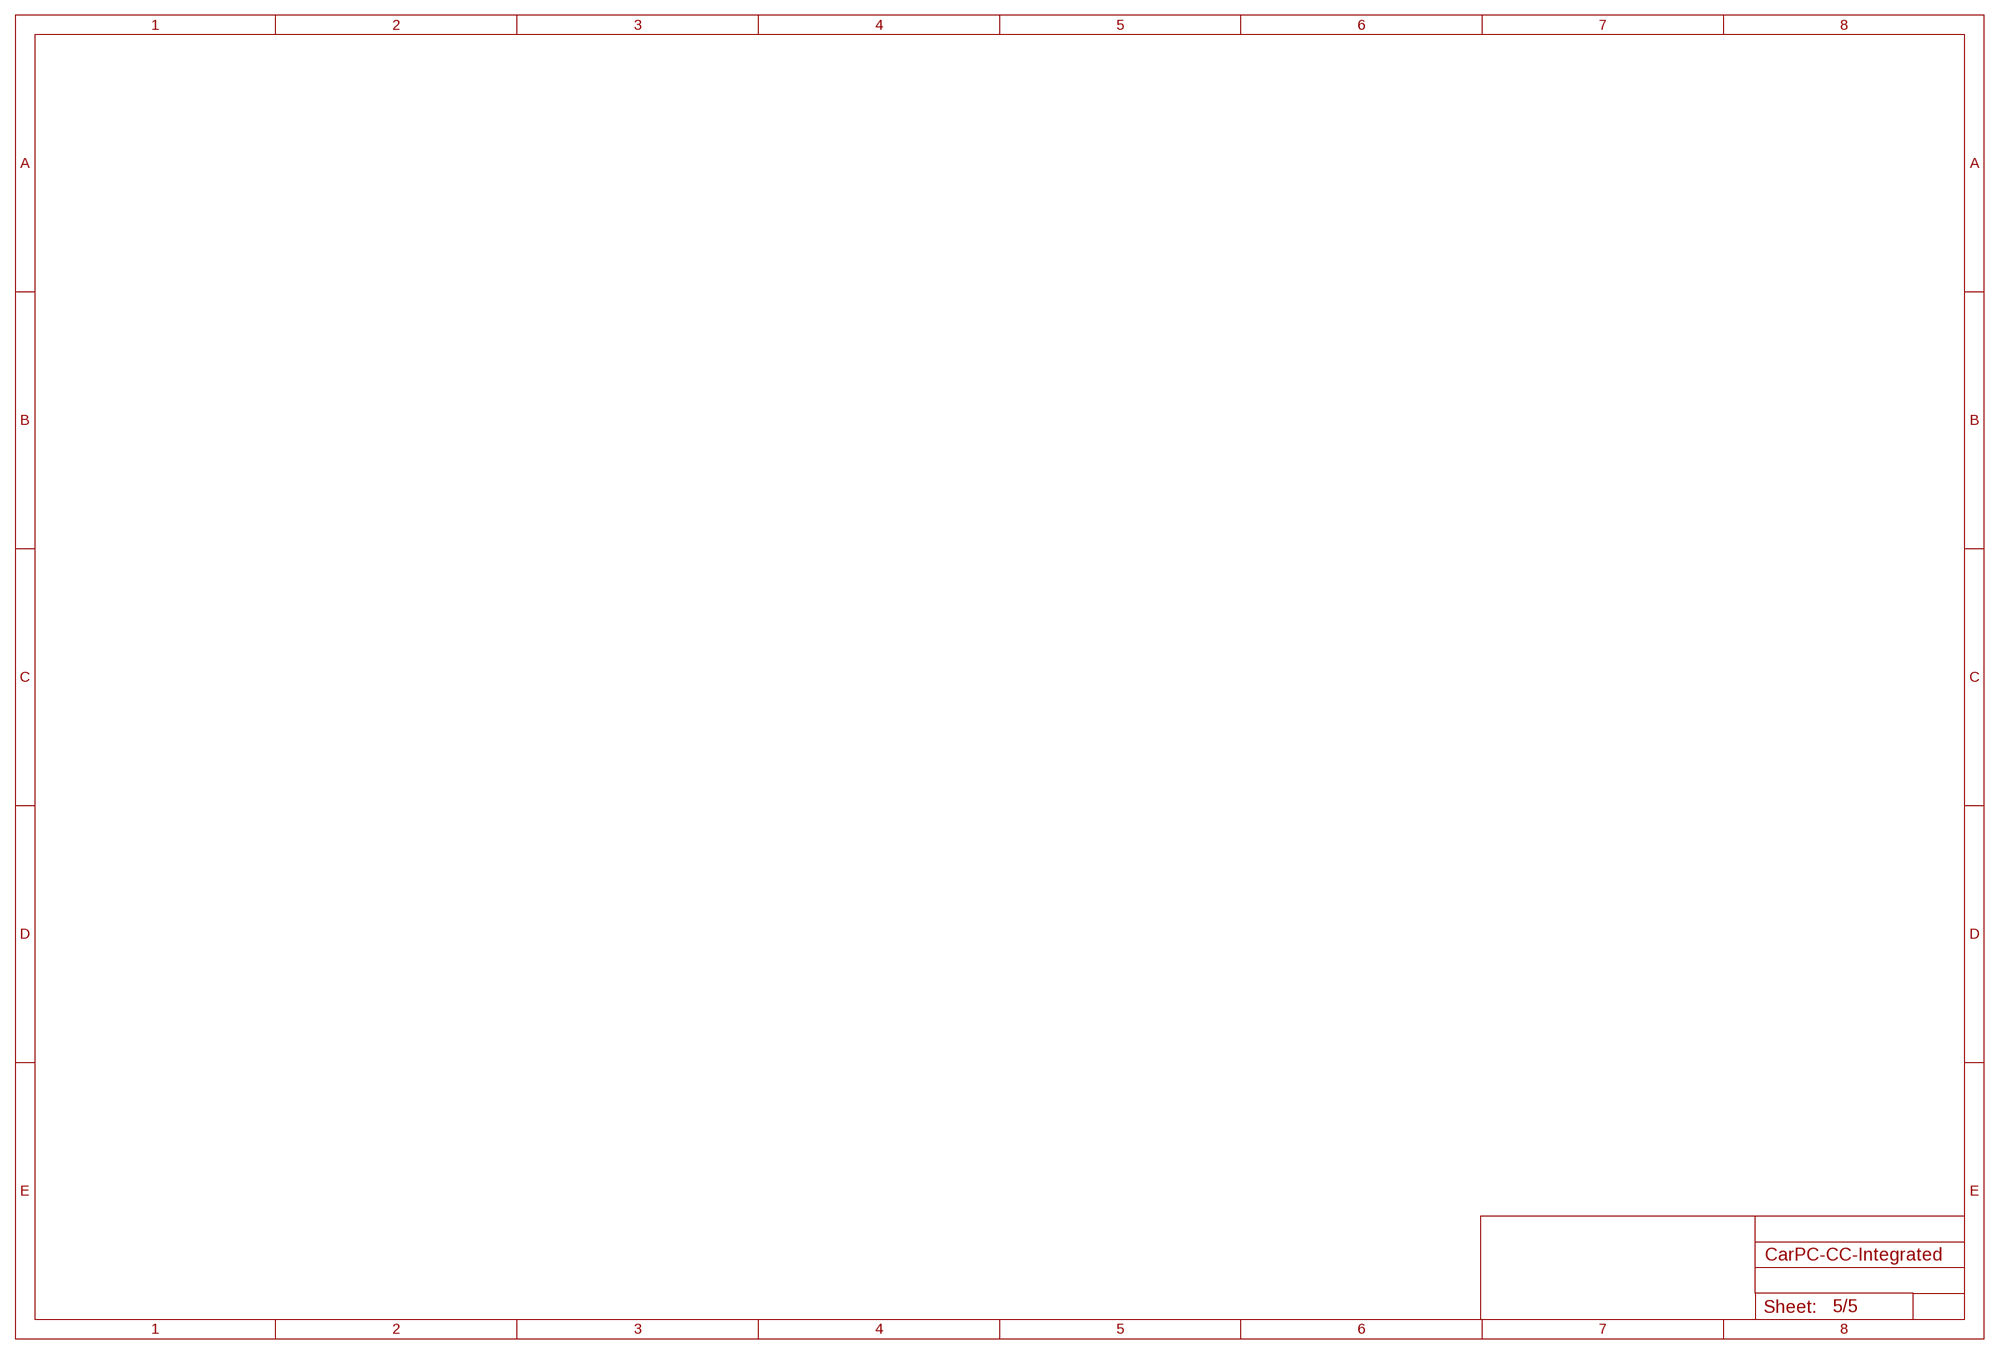
[diagram p5: schematic, sheet 5]

## Library data of the parts
ACTIVITY BT-ACT BT-STA IGN PS3V3 PS5V PS12V-1 PS12V-2 STATUS = Custom:IN-S126ASUW: Standard LEDs - SMD White LED Source: Datasheet <https://componentsearchengine.com/Datasheets/1/IN-S126ASUW.pdf>; DESCRIPTION: Standard LEDs - SMD White LED; HEIGHT: 1mm; MANUFACTURER_NAME: Inolux; MANUFACTURER_PART_NUMBER: IN-S126ASUW; MOUSER_PART_NUMBER: 743-IN-S126ASUW; MOUSER_PRICE-STOCK: https://www.mouser.com/Search/Refine.aspx?Keyword=743-IN-S126ASUW
AP AP-IGN BATT CAN DISPLAY IGN-IN ODROID = con-wago-508:W237-02P: WAGO SREW CLAMP; OC_FARNELL: unknown; OC_NEWARK: unknown
C1-C11 C13-C26 C28-C47 C55 = rcl:C-EU: CAPACITOR, European symbol; SPICEPREFIX: C
C12 C27 = rcl:CPOL-EU: POLARIZED CAPACITOR, European symbol; SPICEPREFIX: C
D1 D2 = Custom:CD1206-B260: BOURNS - CD1206-B260 - DIODE, SCHOTTKY RECT, 60V, 2A, SMD Source: Datasheet <https://componentsearchengine.com/Datasheets/1/CD1206-B260.pdf>; DESCRIPTION: BOURNS - CD1206-B260 - DIODE, SCHOTTKY RECT, 60V, 2A, SMD; HEIGHT: 1.16mm; MANUFACTURER_NAME: Bourns; MANUFACTURER_PART_NUMBER: CD1206-B260; MOUSER_PART_NUMBER: 652-CD1206-B260; MOUSER_PRICE-STOCK: https://www.mouser.com/Search/Refine.aspx?Keyword=652-CD1206-B260
D3 = Custom:PRTR5V0U2AX,235: ESD Suppressors / TVS Diodes Diode TVS Single Uni-Dir 5.5V 4-Pin Source: Datasheet <https://componentsearchengine.com/Datasheets/1/PRTR5V0U2AX,235.pdf>; DESCRIPTION: ESD Suppressors / TVS Diodes Diode TVS Single Uni-Dir 5.5V 4-Pin; HEIGHT: 1mm; MANUFACTURER_NAME: Nexperia; MANUFACTURER_PART_NUMBER: PRTR5V0U2AX,235; MOUSER_PART_NUMBER: 771-PRTR5V0U2AX,235; MOUSER_PRICE-STOCK: https://www.mouser.com/Search/Refine.aspx?Keyword=771-PRTR5V0U2AX%2C235
F1-F3 = Custom:MF-GSMF300_36X-2: Resettable Fuses - PPTC 36V 3.0A-HD 20A MAX Source: Datasheet <https://componentsearchengine.com/Datasheets/1/MF-GSMF300_36X-2.pdf>; DESCRIPTION: Resettable Fuses - PPTC 36V 3.0A-HD 20A MAX; HEIGHT: 1.6mm; MANUFACTURER_NAME: Bourns; MANUFACTURER_PART_NUMBER: MF-GSMF300/36X-2; MOUSER_PART_NUMBER: 652-MF-GSMF300/36X-2; MOUSER_PRICE-STOCK: https://www.mouser.com/Search/Refine.aspx?Keyword=652-MF-GSMF300%2F36X-2
FAN1 FAN2 = Custom:47053-1000: MOLEX - 47053-1000 - HEADER, 4POS, 1ROW, 2.54MM Source: Datasheet <https://componentsearchengine.com/Datasheets/1/47053-1000.pdf>; DESCRIPTION: MOLEX - 47053-1000 - HEADER, 4POS, 1ROW, 2.54MM; HEIGHT: mm; MANUFACTURER_NAME: Molex; MANUFACTURER_PART_NUMBER: 47053-1000; MOUSER_PART_NUMBER: 538-47053-1000; MOUSER_PRICE-STOCK: https://www.mouser.com/Search/Refine.aspx?Keyword=538-47053-1000
H1-H4 = holes:MOUNT-PAD-ROUND: MOUNTING PAD, round
IC1 = Custom:MCP2515-I_SO: CAN Controller SPI data filtering SO18 Source: Datasheet <https://componentsearchengine.com/Datasheets/1/MCP2515-I_SO.pdf>; DESCRIPTION: CAN Controller SPI data filtering SO18; HEIGHT: 2.65mm; MANUFACTURER_NAME: Microchip; MANUFACTURER_PART_NUMBER: MCP2515-I/SO; MOUSER_PART_NUMBER: 579-MCP2515-I/SO; MOUSER_PRICE-STOCK: https://www.mouser.com/Search/Refine.aspx?Keyword=579-MCP2515-I%2FSO
IC2 = Custom:TJA1050T_CM,118: NXP - TJA1050T/CM,118 - CAN TRANSCEIVER, 1TX/RX, SOIC-8 Source: Datasheet <https://componentsearchengine.com/Datasheets/1/TJA1050T_CM,118.pdf>; DESCRIPTION: NXP - TJA1050T/CM,118 - CAN TRANSCEIVER, 1TX/RX, SOIC-8; HEIGHT: 1.75mm; MANUFACTURER_NAME: Nexperia; MANUFACTURER_PART_NUMBER: TJA1050T/CM,118; MOUSER_PART_NUMBER: 771-TJA1050T/CM118; MOUSER_PRICE-STOCK: https://www.mouser.com/Search/Refine.aspx?Keyword=771-TJA1050T%2FCM118
IC3 = Custom:TXS0108EPWR: TXS0108EPWR, Voltage Level Translator, Open Drain 1.2 3.6 V, 1.65 5.5 V 20-Pin TSSOP Source: Datasheet <http://www.ti.com/lit/ds/symlink/txs0108e.pdf>; DESCRIPTION: TXS0108EPWR, Voltage Level Translator, Open Drain 1.2 3.6 V, 1.65 5.5 V 20-Pin TSSOP; HEIGHT: 1.2mm; MANUFACTURER_NAME: Texas Instruments; MANUFACTURER_PART_NUMBER: TXS0108EPWR; MOUSER_PART_NUMBER: 595-TXS0108EPWR; MOUSER_PRICE-STOCK: https://www.mouser.com/Search/Refine.aspx?Keyword=595-TXS0108EPWR
IC4 = Custom:INA219AIDR: 26-V, Bidirectional, Zero-Drift, High-Side, I2C Out Current/Power Monitor Source: Datasheet <http://www.ti.com/lit/gpn/ina219>; DESCRIPTION: 26-V, Bidirectional, Zero-Drift, High-Side, I2C Out Current/Power Monitor; HEIGHT: 1.75mm; MANUFACTURER_NAME: Texas Instruments; MANUFACTURER_PART_NUMBER: INA219AIDR; MOUSER_PART_NUMBER: 595-INA219AIDR; MOUSER_PRICE-STOCK: https://www.mouser.com/Search/Refine.aspx?Keyword=595-INA219AIDR
IC5 IC6 = Custom:TPS55165QPWPRQ1: 2V to 36V, 1A output, 2MHz, synchronous step-up and step-down converter, AEC-Q100 qualified Source: Datasheet <http://www.ti.com/lit/gpn/tps55165-q1>; DESCRIPTION: 2V to 36V, 1A output, 2MHz, synchronous step-up and step-down converter, AEC-Q100 qualified; HEIGHT: 1.2mm; MANUFACTURER_NAME: Texas Instruments; MANUFACTURER_PART_NUMBER: TPS55165QPWPRQ1; MOUSER_PART_NUMBER: 595-TPS55165QPWPRQ1; MOUSER_PRICE-STOCK: https://www.mouser.com/Search/Refine.aspx?Keyword=595-TPS55165QPWPRQ1
IC7 = Custom:MIC4680-3.3YM: MICREL SEMICONDUCTOR - MIC4680-3.3YM - BUCK, 4-34VIN, 1.3A, 200KHZ, 3.3V, 8SOIC Source: Datasheet <https://componentsearchengine.com/Datasheets/1/MIC4680-3.3YM.pdf>; DESCRIPTION: MICREL SEMICONDUCTOR - MIC4680-3.3YM - BUCK, 4-34VIN, 1.3A, 200KHZ, 3.3V, 8SOIC; HEIGHT: 1.73mm; MANUFACTURER_NAME: Microchip; MANUFACTURER_PART_NUMBER: MIC4680-3.3YM; MOUSER_PART_NUMBER: 998-MIC4680-3.3YM; MOUSER_PRICE-STOCK: https://www.mouser.com/Search/Refine.aspx?Keyword=998-MIC4680-3.3YM
IC8 = Custom:MIC4680-5.0YM-TR: Switching Voltage Regulators 1.3A SuperSwitcher Source: Datasheet <https://componentsearchengine.com/Datasheets/1/MIC4680-5.0YM-TR.pdf>; DESCRIPTION: Switching Voltage Regulators 1.3A SuperSwitcher; HEIGHT: 1.73mm; MANUFACTURER_NAME: Microchip; MANUFACTURER_PART_NUMBER: MIC4680-5.0YM-TR; MOUSER_PART_NUMBER: 998-MIC4680-5.0YMTR; MOUSER_PRICE-STOCK: https://www.mouser.com/Search/Refine.aspx?Keyword=998-MIC4680-5.0YMTR
IC10 = Custom:RN42HID-I_RM: MICROCHIP - RN42HID-I/RM - BLUETOOTH MODULE, V2.1, 3MBPS Source: Datasheet <http://ww1.microchip.com/downloads/en/DeviceDoc/50002328A.pdf>; ALLIED_NUMBER: 70451526; ALLIED_PRICE-STOCK: https://www.alliedelec.com/microchip-technology-inc-rn42hid-i-rm/70451526/; DESCRIPTION: MICROCHIP - RN42HID-I/RM - BLUETOOTH MODULE, V2.1, 3MBPS; HEIGHT: 2mm; MANUFACTURER_NAME: Microchip; MANUFACTURER_PART_NUMBER: RN42HID-I/RM; MOUSER_PART_NUMBER: 765-RN42HID-I/RM; MOUSER_PRICE-STOCK: https://www.mouser.com/Search/Refine.aspx?Keyword=765-RN42HID-I%2FRM; RS_PART_NUMBER: 9123020; RS_PRICE-STOCK: http://uk.rs-online.com/web/p/products/9123020
IC11 = Custom:ATSAMD21G18A-AU-SPLIT: ATMEL - ATSAMD21G18A-AU - MCU, 32BIT, CORTEX-M0+, 48MHZ, TQFP-48 Source: Datasheet <https://componentsearchengine.com/Datasheets/1/ATSAMD21G18A-AU.pdf>; DESCRIPTION: ATMEL - ATSAMD21G18A-AU - MCU, 32BIT, CORTEX-M0+, 48MHZ, TQFP-48; HEIGHT: 1.2mm; MANUFACTURER_NAME: Microchip; MANUFACTURER_PART_NUMBER: ATSAMD21G18A-AU; MOUSER_PART_NUMBER: 556-ATSAMD21G18A-AU; MOUSER_PRICE-STOCK: https://www.mouser.com/Search/Refine.aspx?Keyword=556-ATSAMD21G18A-AU
J1 = Custom:DX4R005HJ5R2000: USB Connectors microUSB 2.0 TYPE B STDMNT RCPT NO TAPER Source: Datasheet <https://www.jae.com/z-en/pdf_download_exec.cfm?param=SJ111770.pdf>; DESCRIPTION: USB Connectors microUSB 2.0 TYPE B STDMNT RCPT NO TAPER; HEIGHT: mm; MANUFACTURER_NAME: JAE Electronics; MANUFACTURER_PART_NUMBER: DX4R005HJ5R2000; MOUSER_PART_NUMBER: 656-DX4R005HJ5R2000; MOUSER_PRICE-STOCK: https://www.mouser.com/Search/Refine.aspx?Keyword=656-DX4R005HJ5R2000
JP-DEBUG = pinhead:PINHD-1X2: PIN HEADER
JP-N2 = pinhead:PINHD-2X20: PIN HEADER
L1 L3 = Custom:SRP7028A-2R2M: Inductor SMD shielded AEC-Q200 2.2uH Bourns SRP7028A Series Shielded Wire-wound SMD Inductor with a Carbonyl Powder Core, 2.2 uH +/-20% 6A Idc Source: Datasheet <https://www.mouser.de/datasheet/2/54/srp7028a-1391359.pdf>; DESCRIPTION: Inductor SMD shielded AEC-Q200 4.7uH Bourns SRP7028A Series Shielded Wire-wound SMD Inductor with a Carbonyl Powder Core, 2.2 uH +/-20% 6A Idc; HEIGHT: 3mm; MANUFACTURER_NAME: Bourns; MANUFACTURER_PART_NUMBER: SRP7028A-2R2M; MOUSER_PART_NUMBER: 652-SRP7028A-2R2M; MOUSER_PRICE-STOCK: https://www.mouser.com/Search/Refine.aspx?Keyword=652-SRP7028A-2R2M
L2 L4 = Custom:SRP7028A-4R7M: Inductor SMD shielded AEC-Q200 4.7uH Bourns SRP7028A Series Shielded Wire-wound SMD Inductor with a Carbonyl Powder Core, 4.7 uH +/-20% 5.5A Idc Source: Datasheet <https://componentsearchengine.com/Datasheets/1/SRP7028A-4R7M.pdf>; DESCRIPTION: Inductor SMD shielded AEC-Q200 4.7uH Bourns SRP7028A Series Shielded Wire-wound SMD Inductor with a Carbonyl Powder Core, 4.7 uH +/-20% 5.5A Idc; HEIGHT: 3mm; MANUFACTURER_NAME: Bourns; MANUFACTURER_PART_NUMBER: SRP7028A-4R7M; MOUSER_PART_NUMBER: 652-SRP7028A-4R7M; MOUSER_PRICE-STOCK: https://www.mouser.com/Search/Refine.aspx?Keyword=652-SRP7028A-4R7M
L5 L6 = Custom:B1047AS-680M=P3: DS75LC Series Inductor 68uH +/-20% 2929 (7373) Source: Datasheet <https://componentsearchengine.com/Datasheets/1/B1047AS-680M=P3.pdf>; DESCRIPTION: DS75LC Series Inductor 68uH +/-20% 2929 (7373); HEIGHT: 5mm; MANUFACTURER_NAME: Murata Electronics; MANUFACTURER_PART_NUMBER: B1047AS-680M=P3; MOUSER_PART_NUMBER: 81-B1047AS-680MP3; MOUSER_PRICE-STOCK: https://www.mouser.com/Search/Refine.aspx?Keyword=81-B1047AS-680MP3
L8 = Custom:742792122: SMD EMI Suppression Ferrite Beads WE-CBF Source: Datasheet <https://componentsearchengine.com/Datasheets/1/742792122.pdf>; DESCRIPTION: SMD EMI Suppression Ferrite Beads WE-CBF; HEIGHT: 1.3mm; MANUFACTURER_NAME: Wurth Elektronik; MANUFACTURER_PART_NUMBER: 742792122; MOUSER_PART_NUMBER: 710-742792122; MOUSER_PRICE-STOCK: https://www.mouser.com/Search/Refine.aspx?Keyword=710-742792122
OK-FAN-CTRL OK-PWR-IGN OK-PWR-N2_DISP = Custom:ILD74
Q1 = crystal:CRYSTAL: CRYSTAL; OC_FARNELL: 1667008; OC_NEWARK: unknown
R1-R5 R7 R9-R12 R14-R18 R20-R23 = rcl:R-EU_: RESISTOR, European symbol; SPICEPREFIX: R
S2 = switch:SKHMP*E010: 6.2 X 6.5mm TACT Switch (SMD) Source: http://www3.alps.co.jp/WebObjects/catalog.woa/PDF/E/Switch/Tact/SKHM/SKHM.PDF
TEMP = pinhead:PINHD-1X3: PIN HEADER
TP1-TP8 = testpad:TP: Test pad
U$4 = Custom:JS-MN-KT
X1 = con-panduit:057-010-: CONNECTOR 10-pin series 057 contact pc board low profile headers; OC_FARNELL: unknown; OC_NEWARK: unknown

## Net classes
0 default: width 0.127 mm, clearance 0.025 mm
1 5v Regulated: width 0.381 mm, clearance 0.025 mm
2 12v Regulated: width 0.381 mm, clearance 0.127 mm
3 11..14v Ignition: width 0.508 mm, clearance 0.127 mm
4 11..14v Generator: width 0.508 mm, clearance 0.127 mm
5 Chassis: width 0.254 mm
6 0v Isolated: width 0.254 mm
7 3V3 Arduino: width 0.076 mm, clearance 0.025 mm
8 5V Signal: width 0.076 mm, clearance 0.025 mm
9 3V3 Signal: width 0.076 mm, clearance 0.025 mm
10 11..14v Unfused: width 2.54 mm, clearance 0.254 mm